# EAGLE schematic Pt100-Amplifier-LM324-2 (EAGLE 7.2.0)
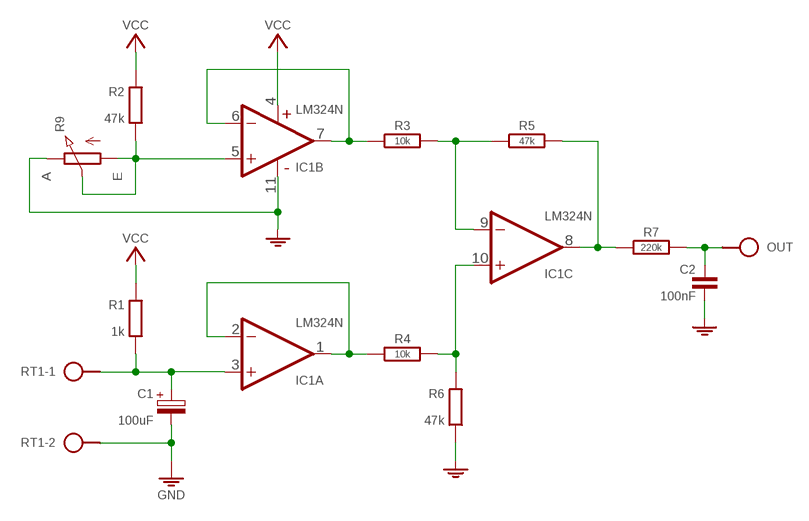
[diagram p0: schematic, sheet 1]

## Parts
C1  100uF  CPOLE2.5-6  [E2,5-6]
C2  100nF  C050-020X044/V  [C050-020X044/V]
IC1  LM324N  [DIL14]
OUT  HPORT  [SPAD]
R1  1k  R0204/2.54  [0204/2.54]
R2  47k  R0204/2.54  [0204/2.54]
R3  10k  R-H0204/10  [0204/10]
R4  10k  R-H0204/12  [0204/12]
R5  47k  R-H0204/2.54  [0204/2.54]
R6  47k  R0204/2.54  [0204/2.54]
R7  220k  R-H0204/10  [0204/10]
R9  POT-TRIM  [TRIM-POT]
RT1  SPAD-2  [SPAD-2]
S5  VCC_GNDPWR-L  [PWR-L]

## Nets
GND: C1.- C2.2 IC1.11(P:V-) R6.2 R9.E RT1.2 S5.1
N$1: C1.+ IC1.3(A:+IN) R1.2 RT1.1
N$2: IC1.1(A:OUT) IC1.2(A:-IN) R4.1
N$3: IC1.10(C:+IN) R4.2 R6.1
N$4: IC1.9(C:-IN) R3.2 R5.1
N$5: IC1.8(C:OUT) R5.2 R7.1
N$6: C2.1 OUT.1 R7.2
N$7: IC1.6(B:-IN) IC1.7(B:OUT) R3.1
N$8: IC1.5(B:+IN) R2.2 R9.A R9.S
VCC: IC1.4(P:V+) R1.1 R2.1 S5.2
Unconnected: IC1.12(D:+IN) IC1.13(D:-IN) IC1.14(D:OUT)

## Library data of the parts
C1 = c:CPOL: POLARIZED CAPACITOR, European symbol
C2 = c:C: CAPACITOR, European symbol
IC1 = ic:LM324: Single Supply Quad Operational Amplifiers http://www.ti.com/lit/ds/symlink/lm324.pdf
OUT = pad:HPORT
R1 R2 R6 = r:R: RESISTOR, European symbol
R3-R5 R7 = r:R-H
R9 = r:POT
RT1 = pad:SPAD-2
S5 = pad:VCC_GND